# Altium schematic sheet wlpkt1_zas.SchDoc: Zasilacz
size A4; DocumentNumber: 4; SheetNumber: 4; SheetTotal: 5
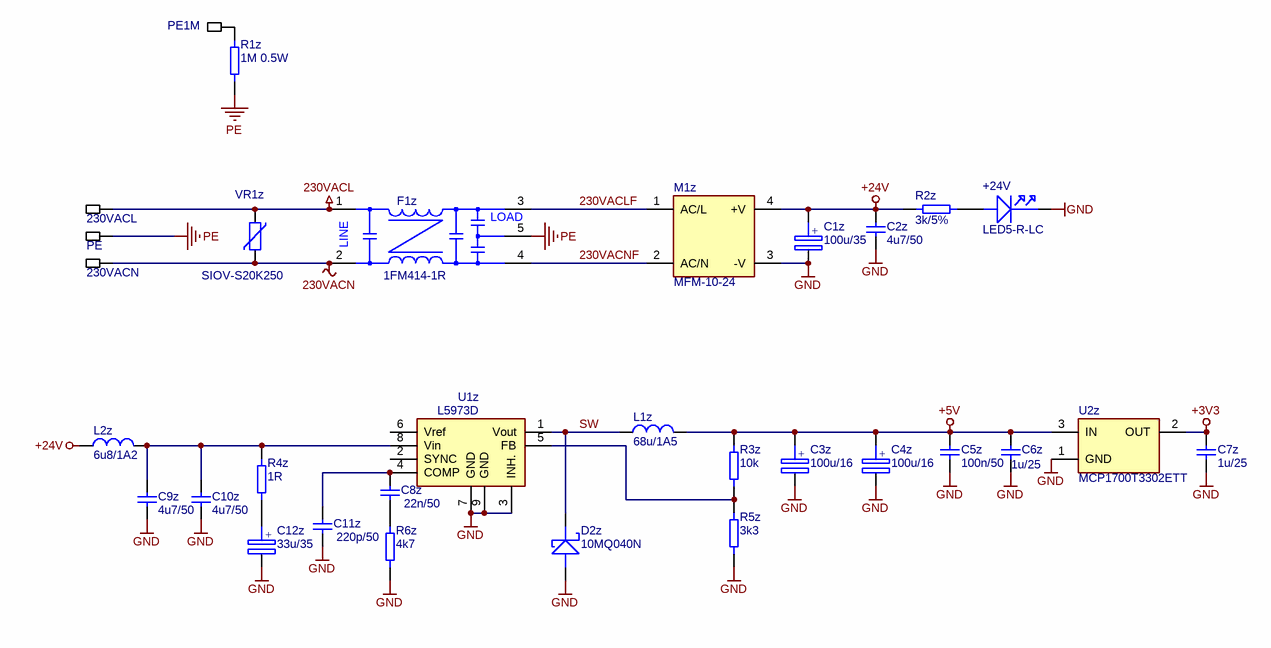
[diagram p0: wlpkt1_zas.SchDoc]

## Parts
230VACL  PAD1_5MM  [PAD1_5MM]  (value not drawn)  (no BOM)
230VACN  PAD1_5MM  [PAD1_5MM]  (value not drawn)  (no BOM)
+24V  LED5-R-LC  [CO26]
C1z  100u/35  [CE1028]
C2z  4u7/50  [1210]
C3z  100u/16  [CEL7343-43]
C4z  100u/16  [CEL7343-43]
C5z  100n/50  [0805]
C6z  1u/25  [0805]
C7z  1u/25  [0805]
C8z  22n/50  [0603-IPC]
C9z  4u7/50  [1210]
C10z  4u7/50  [1210]
C11z  220p/50  [0603-IPC]
C12z  33u/35  [CEL7343-31]
D2z  10MQ040N  [SMA]
F1z  1FM414-1R  [1FM414]
L1z  68u/1A5  [SRR1208]
L2z  6u8/1A2  [WE-PD3]
M1z  MFM-10-24  [MFM-10-24]
PE  PAD1_5MM  [PAD1_5MM]  (value not drawn)  (no BOM)
PE1M  PAD1_5MM  [PAD1_5MM]  (value not drawn)  (no BOM)
R1z  1M 0.5W  [R502816]
R2z  3k/5%  [R402510V]
R3z  10k  [0805R]
R4z  1R  [R402510]
R5z  3k3  [0805R]
R6z  4k7  [0603R]
U1z  L5973D  [HSOP8]
U2z  MCP1700T3302ETT  [SOT23-3]
VR1z  SIOV-S20K250  [SIOV-S20K275]

## Nets
230VACL: 230VACL.1 F1z.1(IN1) VR1z.1
230VACN: 230VACN.1 F1z.2(IN2) VR1z.2
+3V3: C7z.1 U2z.2(OUT)
+5V: C3z.2 C4z.2 C5z.2 C6z.1 L1z.2 R3z.1 U2z.3(IN)
+24V: C1z.2 C2z.1 L2z.1 M1z.4(+V) R2z.1
GND: +24V.CATH C1z.1 C2z.2 C3z.1 C4z.1 C5z.1 C6z.2 C7z.2 C9z.2 C10z.2 C11z.2 C12z.1 D2z.2(ANOD) M1z.3(-V) R5z.2 R6z.2 U1z.3(INH.) U1z.7(GND) U1z.9(GND) U2z.1(GND)
PE: F1z.5 PE.1 R1z.1
230VACLF: F1z.3(OUT2) M1z.1(AC/L)
230VACNF: F1z.4(OUT1) M1z.2(AC/N)
SW: D2z.1(CATH) L1z.1 U1z.1(Vout)
Net+24V_ANOD: +24V.ANOD R2z.2
NetC8z_1: C8z.1 C11z.1 U1z.4(COMP)
NetC8z_2: C8z.2 R6z.1
NetC9z_1: C9z.1 C10z.1 L2z.2 R4z.1 U1z.8(Vin)
NetC12z_2: C12z.2 R4z.2
NetPE1M_1: PE1M.1 R1z.2
NetR3z_2: R3z.2 R5z.1 U1z.5(FB)

Not connected (* = marked no-connect by the designer): U1z 2(SYNC) 6(Vref)

## Notes on the sheet
- Jeżeli nie wskazano inaczej, tolerancja rezystorów wynosi 1%
- Nazwa modułu (skrót)
- Słowna nazwa modułu
- Rozmiar arkusza
- A4
- Projektował
- Rysował
- Podpis
- Data:
- Ark.
- z
- Wer.
- (in symbol CAP13) +
- (in symbol CAP15) +
- (in symbol CAP71) +
- (in symbol Ind14) LOAD; LINE

## Library data of the parts
230VACL 230VACN PE PE1M = NOB33: Kod: NOB33; ID: 33; Descript: bd; Value: PAD1_5MM
+24V = Opt27: Kod: Opt27; ID: 27; Descript: LED; 5mm; czerwony; 20mcd; 30°; Czoło: wypukłe; Raster:2,54mm; Reference5: OSNR5134A; Value: LED5-R-LC; Price5: 0; DateOfPrice5: 2010-01-01; Supplier5: tme.pl; Manufacturer5: OptoSupply; Typ5: OSNR5134A
C1z = CAP15: PartIdx: CAP15; Descript: Kondensator: elektrolityczny; THT; 100uF; 35VDC; Ø6,3x11mm; ±20%; Reference5: SD1V107M6L011BB; Identyfikator: 15; Value: 100u/35; Supplier5: tme.pl; Manufacturer5: SAMHA; Typ5: SD1V107M6L011BB; Price5: 0; DateOfPrice5: 01-01-2010; ID: 15
C2z = CAP99: PartIdx: CAP99; Descript: Kondensator: ceramiczny; 4,7uF; 50V; X7R; ±10%; SMD; 1210; -55÷125°C; Reference5: CL32B475KBUYNNE; Identyfikator: 99; Value: 4u7/50; Supplier5: tme.pl; Manufacturer5: Samsung; Typ5: CL32B475KBUYNNE; Price5: 2; DateOfPrice5: 01-01-2010; ID: 99
C3z C4z = CAP13: Descript: Kondensator: tantalowy; low ESR; 100uF; 16VDC; Obud: E; 2917; TPS; Reference5: TPSE107M016R0100; Kod: CAP13; ID: 13; Value: 100u/16; Supplier5: tme.pl; Manufacturer5: AVX; Typ5: TPSE107M016R0100; Price5: 2; DateOfPrice5: 2010-01-01
C5z = CAP7: Descript: Kondensator: ceramiczny; MLCC; 100nF; 50V; X7R; ±10%; SMD; 0805; Reference5: CL21B104KBCNNNC; Kod: CAP7; ID: 7; Value: 100n/50; Supplier5: tme.pl; Manufacturer5: Samsung; Typ5: CL21B104KBCNNNC; Price5: 0; DateOfPrice5: 2010-01-01
C6z C7z = CAP38: Kod: CAP38; ID: 38; Descript: Kondensator: ceramiczny; MLCC; 1uF; 25V; X7R; ±10%; SMD; 0805; Reference5: CL21B105KAFNNN; Value: 1u/25; Price5: 0; DateOfPrice5: 2010-01-01; Supplier5: tme.pl; Manufacturer5: Samsung; Typ5: CL21B105KAFNNN
C8z = CAP51: Descript: Kondensator: ceramiczny; 22nF; 50V; X7R; ±10%; SMD; 0603; -55÷125°C; Reference5: CL10B223KB8NNNC; Kod: CAP51; ID: 51; Value: 22n/50; Supplier5: tme.pl; Manufacturer5: Samsung; Typ5: CL10B223KB8NNNC; Price5: 0; DateOfPrice5: 2010-01-01
C9z C10z = CAP99: Kod: CAP99; ID: 99; Descript: Kondensator: ceramiczny; 4,7uF; 50V; X7R; ±10%; SMD; 1210; -55÷125°C; Reference5: CL32B475KBUYNNE; Value: 4u7/50; Price5: 1,9; DateOfPrice5: 2020-11-08; Supplier5: tme.pl; Manufacturer5: Samsung; Typ5: CL32B475KBUYNNE
C11z = CAP45: Descript: Kondensator: ceramiczny; 220pF; 50V; X7R; ±10%; SMD; 0603; -55÷125°C; Reference5: CL10B221KB8NNNC; Kod: CAP45; ID: 45; Value: 220p/50; Supplier5: tme.pl; Manufacturer5: Samsung; Typ5: CL10B221KB8NNNC; Price5: 0; DateOfPrice5: 2010-01-01
C12z = CAP71: Descript: Kondensator: tantalowy; 33uF; 35VDC; SMD; Obud: D; 2917; ±10%; Reference5: TAJD336K035R; Kod: CAP71; ID: 71; Value: 33u/35; Supplier5: tme.pl; Manufacturer5: AVX; Typ5: TAJD336K035R; Price5: 8; DateOfPrice5: 2010-01-01
D2z = DIO1: Descript: Dioda: prostownicza Schottky; SMD; 40V; 2,1A; DO214AC; Reference5: 10MQ040NTRPBF; Typ5: VS-10MQ040NTRPBF; Kod: DIO1; ID: 1; Value: 10MQ040N; Supplier5: tme.pl; Price5: 0; DateOfPrice5: 2010-01-01; Manufacturer5: Vishay
F1z = Ind14: PartIdx: Ind14; Descript: Radio filter 250VAC, 1A; Identyfikator: 14; Value: 1FM414-1R; Reference5: 1FM414-1R; Supplier5: tme.pl; Manufacturer5: FilterCon; Price5: 15; DateOfPrice5: 01-01-2010; ID: 14; InductCurr: -; Typ5: -
L1z = Ind35: Descript: Power choke 68uH, 1.5A, 12x12mm; Reference5: DE1205-68; Kod: Ind35; InductCurr: 1,5A; ID: 35; Value: 68u/1A5; Supplier5: tme.pl; Manufacturer5: Ferrocore; Typ5: DE1205-68; Price5: 1; DateOfPrice5: 2010-01-01
L2z = Ind38: Kod: Ind38; ID: 38; Descript: Cewka zasilająca (SMD), 6.8 µH, 1.2 A, 500 mA, Seria WE-PD3, 6.6mm x 4.45mm x 2.92mm, Osłonięte; Reference5: 1636061; Typ5: 744 51 068; Value: 6u8/1A2; Price5: 11; DateOfPrice5: 2010-01-01; Supplier5: farnell.com; Manufacturer5: Würth Elektronik
M1z = Mod92: Kod: Mod92; ID: 92; Descript: Zasilacz: impulsowy; 10W; 80÷264VAC; Wyjścia: 1; 420mA; -30÷85°C; Value: MFM-10-24; Price5: 35; DateOfPrice5: 2010-01-01; Supplier5: tme.pl; Reference5: MFM-10-24; Manufacturer5: MeanWell; Typ5: MFM-10-24
R1z = Res69: PartIdx: Res69; Descript: Resistor 1 megaohm, 0.5W, 5%; Reference5: 1/2W-1M; Identyfikator: 69; Typ5: brak danych; Value: 1M 0.5W; Supplier5: tme.pl; Price5: 0,1; DateOfPrice5: 25-06-2020 12:16:54; Manufacturer5: brak danych; ID: 69
R2z = Res284: Kod: Res284; ID: 284; Descript: ML0.25W-3K-5% Rezystor metalizowany THT 3kom; 0,25W; ±5%;; Reference5: bd; Value: 3k/5%; Price5: 0,2; DateOfPrice5: 2020-12-27; Supplier5: mlach; Manufacturer5: bd; Typ5: bd
R3z = Res16: Descript: Rezystor: thick film; SMD; 0805; 10kom; 0,125W; ±1%; -55÷125°C; Reference5: SMD0805-10K-1%; Typ5: 0805S8F1002T5E; Kod: Res16; ID: 16; Value: 10k; Supplier5: tme.pl; Manufacturer5: Royal Ohm; Price5: 0,1; DateOfPrice5: 2020-06-25
R4z = Res72: Kod: Res72; ID: 72; Descript: Rezystor: metal film; THT; 1om; 0,6W; ±1%; Ø2,5x6,8mm; 200ppm/°C; Reference5: M0.6W-1R; Typ5: MF006FJ100KA50; Value: 1R; Price5: 0,1; DateOfPrice5: 2020-06-25; Supplier5: tme.pl; Manufacturer5: Royal Ohm
R5z = Res145: Descript: Rezystor: thick film; SMD; 0805; 3,3kΩ; 0,125W; ±1%; -55÷125°C; Reference5: SMD0805-3K3-1%; Typ5: 0805S8F3301T5E; Kod: Res145; ID: 145; Value: 3k3; Supplier5: tme.pl; Manufacturer5: Royal Ohm; Price5: 0,1; DateOfPrice5: 2020-06-25
R6z = Res171: Descript: Rezystor: thick film; SMD; 0603; 4,7kom; 0,1W; ±1%; -55÷125°C; Reference5: SMD0603-4K7-1%; Typ5: 0603SAF4701T5E; Kod: Res171; ID: 171; Value: 4k7; Supplier5: tme.pl; Manufacturer5: Royal Ohm; Price5: 0,1; DateOfPrice5: 2020-06-25
U1z = ICs119: Descript: Driver; przetwornica DC/DC; 2,5A; 1,2÷35V; 2,25W; Kanały: 1; 250kHz; Kod: ICs119; ID: 119; Value: L5973D; Supplier5: tme.pl; Reference5: L5973D; Manufacturer5: ST; Typ5: L5973D; Price5: 10; DateOfPrice5: 2010-01-01
U2z = ICs182: Kod: ICs182; ID: 182; Descript: Stabilizator napięcia; LDO, nieregulowany; 3,3V; 0,25A; SOT23-3; Typ5: MCP1700T3302E/TT; Value: MCP1700T3302ETT; Price5: 1,8; DateOfPrice5: 2020-05-10; Supplier5: tme.pl; Reference5: MCP1700T3302ETT; Manufacturer5: Microchip
VR1z = Vre35: PartIdx: Vre35; Descript: Warystor: metalowo-tlenkowy; THT; 250VAC; 320VDC; 390V; 8000A; 140J; Identyfikator: 35; Value: SIOV-S20K250; Reference5: SIOV-S20K250; Supplier5: tme.pl; Manufacturer5: Epcos; Price5: 2,6; Typ5: S20K250; DateOfPrice5: 03-06-2020; ID: 35